# Altium schematic sheet ESP32.SchDoc
size 558 x 431 mm; SheetNumber: 1; SheetTotal: 1; ENG_APP_DATE: --/--/--; DSN_APP_DATE: --/--/--; CHK_APP_DATE: --/--/--
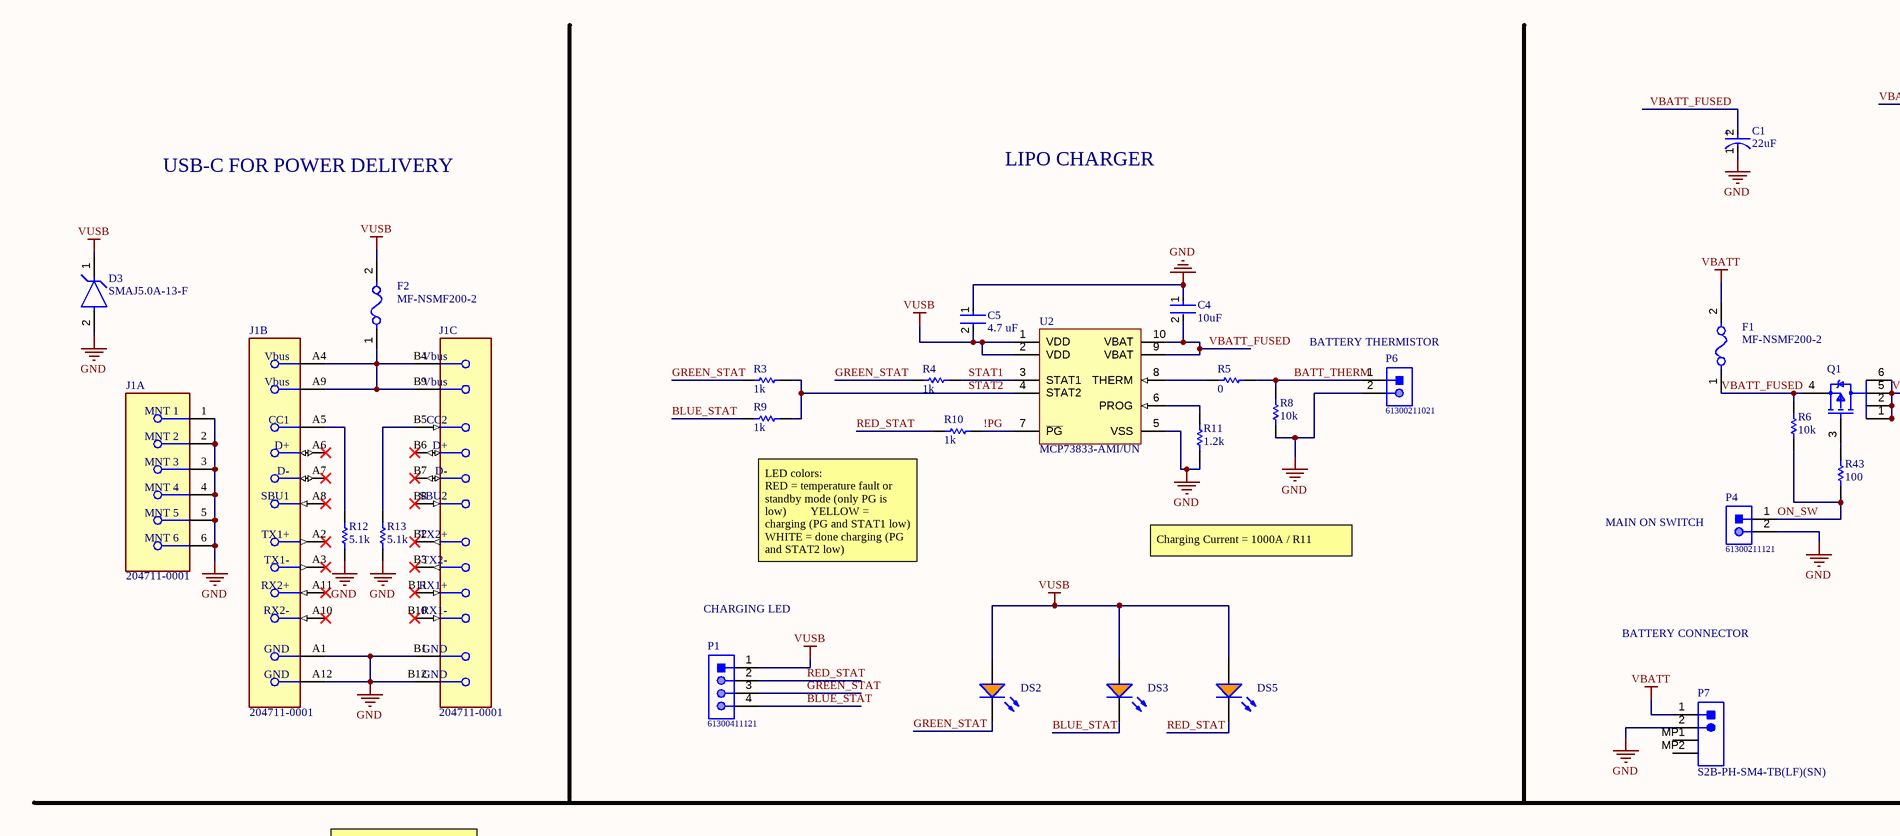
[diagram p0: ESP32.SchDoc, top left]
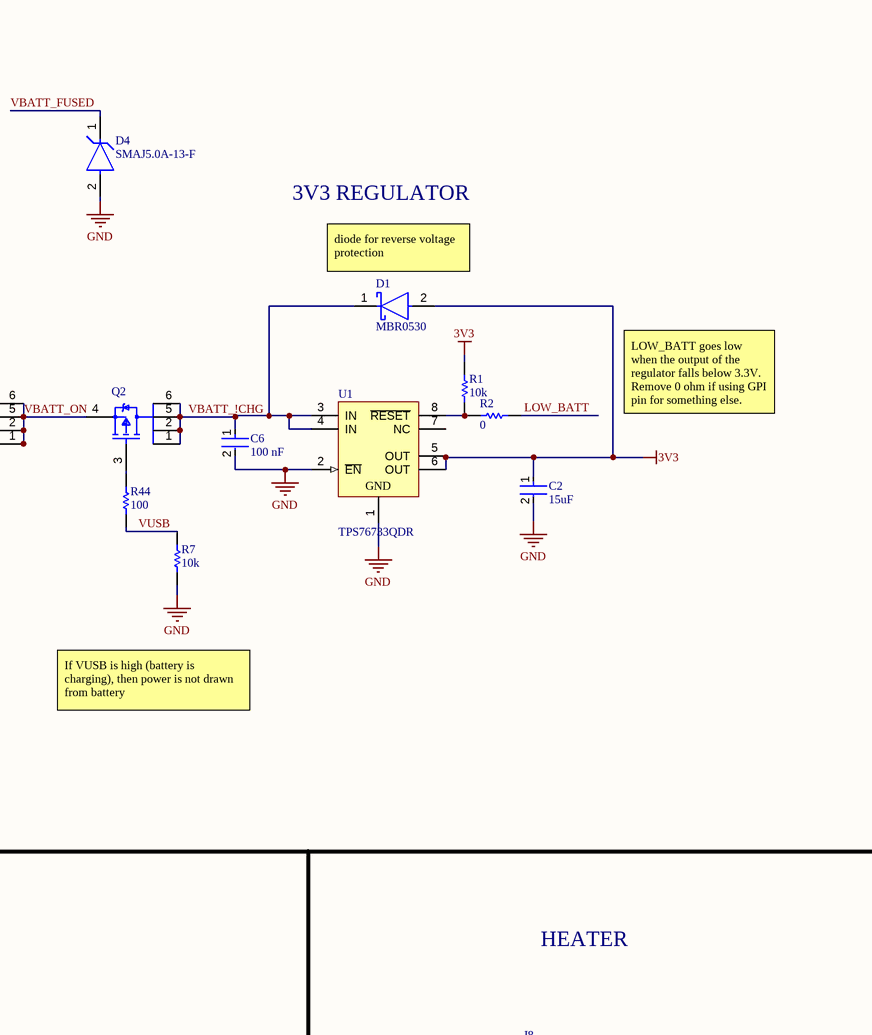
[diagram p1: ESP32.SchDoc, top right]
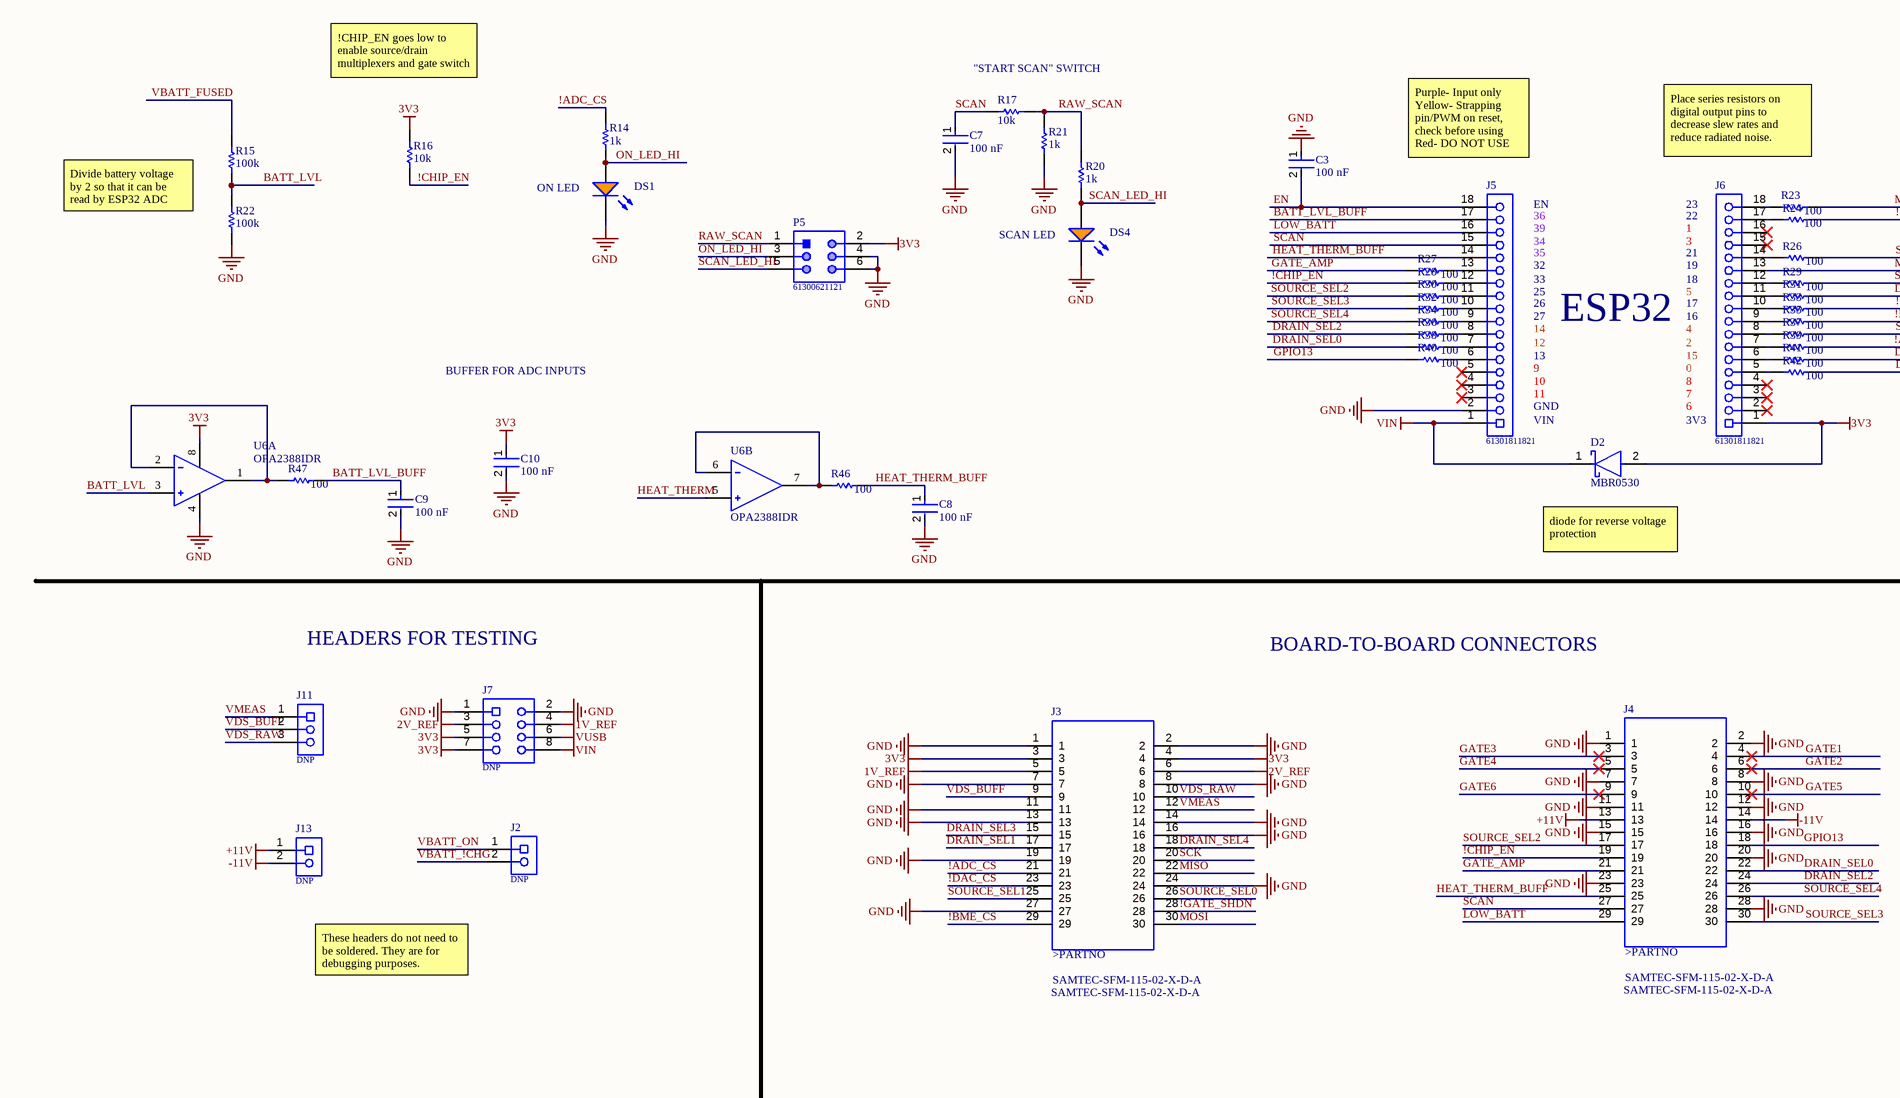
[diagram p2: ESP32.SchDoc, bottom left]
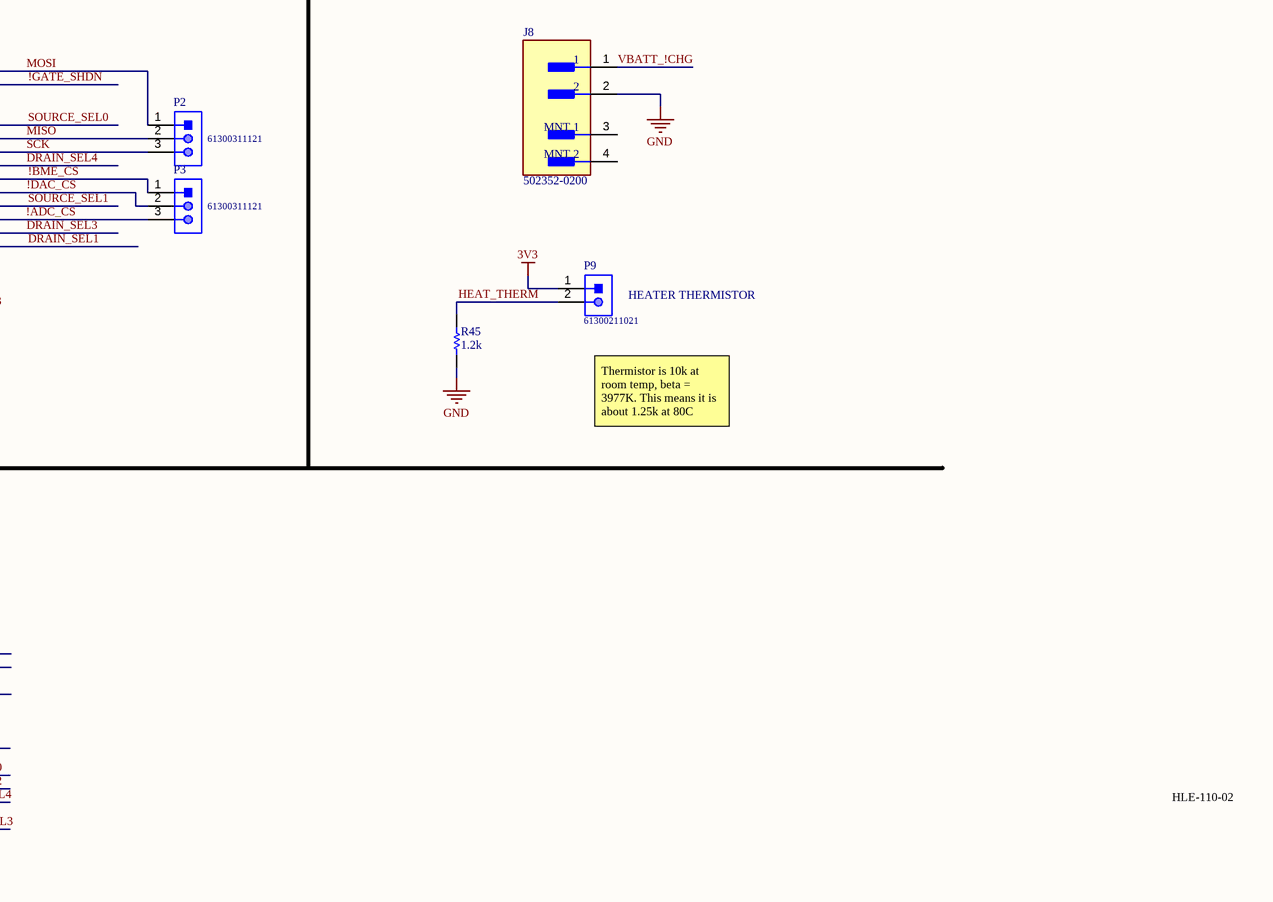
[diagram p3: ESP32.SchDoc, bottom right]

## Parts
C1  22uF  [FP-FKC-MFG]
C2  15uF  [FP-C2012-125-0_2-MFG]
C3  100 nF  [FP-C0805C-DN-MFG]
C4  10uF  [FP-GRM21B-0_1-IPC_C]
C5  4.7 uF  [FP-C0805C475K3PACTU-MFG]
C6  100 nF  [FP-C0805C-DN-MFG]
C7  100 nF  [FP-C0805C-DN-MFG]
C8  100 nF  [FP-C0805C-DN-MFG]
C9  100 nF  [FP-C0805C-DN-MFG]
C10  100 nF  [FP-C0805C-DN-MFG]
D1  MBR0530  [FP-425-04-MFG]
D2  MBR0530  [FP-425-04-MFG]
D3  SMAJ5.0A-13-F  [FP-SMA-MFG]
D4  SMAJ5.0A-13-F  [FP-SMA-MFG]
DS1  HSMD-C170  [AVAG-HSMX-C170_V]  (value not drawn)
DS2  HSMD-C170  [AVAG-HSMX-C170_V]  (value not drawn)
DS3  HSMD-C170  [AVAG-HSMX-C170_V]  (value not drawn)
DS4  HSMD-C170  [AVAG-HSMX-C170_V]  (value not drawn)
DS5  HSMD-C170  [AVAG-HSMX-C170_V]  (value not drawn)
F1  MF-NSMF200-2  [FP-MF-NSMF200-2-MFG]
F2  MF-NSMF200-2  [FP-MF-NSMF200-2-MFG]
J1  204711-0001  [FP-204711-0001-MFG]  (parts A,B,C of 3)
J2  DNP  [61300211821]
J3  SAMTEC-SFM-115-02-X-D-A  [SAMTEC-SFM-115-02-X-D-A]
J4  SAMTEC-SFM-115-02-X-D-A  [SAMTEC-SFM-115-02-X-D-A]
J5  61301811821  [61301811821]
J6  61301811821  [61301811821]
J7  DNP  [61300821821]
J8  502352-0200  [FP-502352-0200-MFG]
J11  DNP  [61300311821]
J13  DNP  [61300211821]
P1  61300411121  [61300411121]
P2  61300311121  [61300311121]
P3  61300311121  [61300311121]
P4  61300211121  [61300211121]
P5  61300621121  [61300621121]
P6  61300211021  [61300211021]
P7  S2B-PH-SM4-TB(LF)(SN)  [JST- S2B-PH-SM4-TB(LF)(SN)-2_V]
P9  61300211021  [61300211021]
Q1  SI3493DDV-T1-GE3  [FP-C-06593-MFG]  (value not drawn)
Q2  SI3493DDV-T1-GE3  [FP-C-06593-MFG]  (value not drawn)
R1  10k  [RESC2013X60X35NL10T20]
R2  0  [RESC2013X50X30LL20T20]
R3  1k  [RESC2013X55X40LL15T20]
R4  1k  [RESC2013X55X40LL15T20]
R5  0  [RESC2013X50X30LL20T20]
R6  10k  [RESC2013X60X35NL10T20]
R7  10k  [RESC2013X60X35NL10T20]
R8  10k  [RESC2013X60X35NL10T20]
R9  1k  [RESC2013X55X40LL15T20]
R10  1k  [RESC2013X55X40LL15T20]
R11  1.2k  [RESC2013X60X40LL20T25]
R12  5.1k  [RESC2013X60X40LL20T25]
R13  5.1k  [RESC2013X60X40LL20T25]
R14  1k  [RESC2013X55X40LL15T20]
R15  100k  [RESC2013X55X40LL15T20]
R16  10k  [RESC2013X60X35NL10T20]
R17  10k  [RESC2013X60X35NL10T20]
R20  1k  [RESC2013X55X40LL15T20]
R21  1k  [RESC2013X55X40LL15T20]
R22  100k  [RESC2013X55X40LL15T20]
R23  100  [RESC2013X50X30LL20T20]
R24  100  [RESC2013X50X30LL20T20]
R26  100  [RESC2013X50X30LL20T20]
R27  100  [RESC2013X50X30LL20T20]
R28  100  [RESC2013X50X30LL20T20]
R29  100  [RESC2013X50X30LL20T20]
R30  100  [RESC2013X50X30LL20T20]
R31  100  [RESC2013X50X30LL20T20]
R32  100  [RESC2013X50X30LL20T20]
R33  100  [RESC2013X50X30LL20T20]
R34  100  [RESC2013X50X30LL20T20]
R35  100  [RESC2013X50X30LL20T20]
R36  100  [RESC2013X50X30LL20T20]
R37  100  [RESC2013X50X30LL20T20]
R38  100  [RESC2013X50X30LL20T20]
R39  100  [RESC2013X50X30LL20T20]
R40  100  [RESC2013X50X30LL20T20]
R41  100  [RESC2013X50X30LL20T20]
R42  100  [RESC2013X50X30LL20T20]
R43  100  [RESC2013X50X30LL20T20]
R44  100  [RESC2013X50X30LL20T20]
R45  1.2k  [RESC2013X60X40LL20T25]
R46  100  [RESC2013X50X30LL20T20]
R47  100  [RESC2013X50X30LL20T20]
U1  TPS76733QDR  [D0008A_M]
U2  MCP73833-AMI/UN  [MSOP-UN10_L]
U6  OPA2388IDR  [FP-D0008A-IPC_B]  (parts A,B of 2)

## Nets
1V_REF: J3.5 J7.4
2V_REF: J3.6 J7.3
3V3: C2.1 C10.1 D1.2(A) D2.2(A) J3.3 J3.4 J6.1 J7.5 J7.7 P5.2 P9.1 R1.2 R16.2 U1.5(OUT) U1.6(OUT) U6.8(V+)
+11V: J4.13 J13.1
-11V: J4.14 J13.2
GND: C1.1(C) C2.2 C3.1 C4.1 C5.1 C6.2 C7.2 C8.2 C9.2 C10.2 D3.2(A) D4.2(A) DS1.2(K) DS4.2(K) J1.1(MNT_1) J1.2(MNT_2) J1.3(MNT_3) J1.4(MNT_4) J1.5(MNT_5) J1.6(MNT_6) J1.A1(GND) J1.A12(GND) J1.B1(GND) J1.B12(GND) J3.1 J3.2 J3.7 J3.8 J3.11 J3.13 J3.14 J3.16 J3.19 J3.24 J3.27 J4.1 J4.2 J4.7 J4.8 J4.11 J4.12 J4.15 J4.16 J4.20 J4.23 J4.28 J5.2 J7.1 J7.2 J8.2 P4.2 P5.4 P5.6 P6.2 P7.2 R7.1 R8.1 R11.1 R12.1 R13.1 R21.2 R22.1 R45.1 U1.1(GND) U1.2(~{EN}) U2.5(VSS) U6.4(V-)
VBATT: F1.2 P7.1
VIN: D2.1(C) J5.1 J7.8
VUSB: C5.2 D3.1(C) DS2.1(A) DS3.1(A) DS5.1(A) F2.2 J7.6 P1.1 R7.2 R44.1 U2.1(VDD) U2.2(VDD)
!ADC_CS: J3.21 P3.3 R14.2 R39.2
!BME_CS: J3.29 P3.1 R33.2
!CHIP_EN: J4.19 R16.1 R28.1
!DAC_CS: J3.23 P3.2 R35.2
!GATE_SHDN: J3.28 R24.2
!PG: R10.2 U2.7(~{PG})
BATT_LVL: R15.1 R22.2 U6.3(+IN_A)
BATT_LVL_BUFF: C9.1 J5.17 R47.2
BATT_THERM: P6.1 R5.2 R8.2
BLUE_STAT: DS3.2(K) P1.4 R9.1
DRAIN_SEL0: J4.22 R38.1
DRAIN_SEL1: J3.17 R42.2
DRAIN_SEL2: J4.24 R36.1
DRAIN_SEL3: J3.15 R41.2
DRAIN_SEL4: J3.18 R31.2
EN: C3.2 J5.18
GATE1: J4.4
GATE2: J4.6
GATE3: J4.3
GATE4: J4.5
GATE5: J4.10
GATE6: J4.9
GATE_AMP: J4.21 R27.1
GPIO13: J4.18 R40.1
GREEN_STAT: DS2.2(K) P1.3 R3.1 R4.1
HEAT_THERM: P9.2 R45.2 U6.5(+IN_B)
HEAT_THERM_BUFF: C8.1 J4.25 J5.14 R46.2
LOW_BATT: J4.29 J5.16 R2.2
MISO: J3.22 J6.13 P2.2
MOSI: J3.30 P2.1 R23.2
ON_LED_HI: DS1.1(A) P5.3 R14.1
ON_SW: P4.1 R6.2 R43.1
RAW_SCAN: P5.1 R17.1 R20.2 R21.1
RED_STAT: DS5.2(K) P1.2 R10.1
SCAN: C7.1 J4.27 J5.15 R17.2
SCAN_LED_HI: DS4.1(A) P5.5 R20.1
SCK: J3.20 P2.3 R29.2
SOURCE_SEL0: J3.26 R26.2
SOURCE_SEL1: J3.25 R37.2
SOURCE_SEL2: J4.17 R30.1
SOURCE_SEL3: J4.30 R32.1
SOURCE_SEL4: J4.26 R34.1
STAT1: R4.2 U2.3(STAT1)
STAT2: R3.2 R9.2 U2.4(STAT2)
VBATT_!CHG: C6.1 D1.1(C) J2.2 J8.1 Q2.1(D) Q2.2(D) Q2.5(D) Q2.6(D) U1.3(IN) U1.4(IN)
VBATT_FUSED: C1.2(A) C4.2 D4.1(C) F1.1 Q1.4(S) R6.1 R15.2 U2.9(VBAT) U2.10(VBAT)
VBATT_ON: J2.1 Q1.1(D) Q1.2(D) Q1.5(D) Q1.6(D) Q2.4(S)
VDS_BUFF: J3.9 J11.2
VDS_RAW: J3.10 J11.3
VMEAS: J3.12 J11.1
NetF2_1: F2.1 J1.A4(Vbus) J1.A9(Vbus) J1.B4(Vbus) J1.B9(Vbus)
NetJ1_A5: J1.A5(CC1) R12.2
NetJ1_B5: J1.B5(CC2) R13.2
NetJ5_6: J5.6 R40.2
NetJ5_7: J5.7 R38.2
NetJ5_8: J5.8 R36.2
NetJ5_9: J5.9 R34.2
NetJ5_10: J5.10 R32.2
NetJ5_11: J5.11 R30.2
NetJ5_12: J5.12 R28.2
NetJ5_13: J5.13 R27.2
NetJ6_5: J6.5 R42.1
NetJ6_6: J6.6 R41.1
NetJ6_7: J6.7 R39.1
NetJ6_8: J6.8 R37.1
NetJ6_9: J6.9 R35.1
NetJ6_10: J6.10 R33.1
NetJ6_11: J6.11 R31.1
NetJ6_12: J6.12 R29.1
NetJ6_14: J6.14 R26.1
NetJ6_17: J6.17 R24.1
NetJ6_18: J6.18 R23.1
NetQ1_3: Q1.3(G) R43.2
NetQ2_3: Q2.3(G) R44.2
NetR1_1: R1.1 R2.1 U1.8(~{RESET})
NetR5_1: R5.1 U2.8(THERM)
NetR11_2: R11.2 U2.6(PROG)
NetR46_1: R46.1 U6.6(-IN_B) U6.7(OUT_B)
NetR47_1: R47.1 U6.1(OUT_A) U6.2(-IN_A)

Not connected (* = marked no-connect by the designer): J1 A2(TX1+)* A3(TX1-)* A6(D+)* A7(D-)* A8(SBU1)* A10(RX2-)* A11(RX2+)* B2(TX2+)* B3(TX2-)* B6(D+)* B7(D-)* B8(SBU2)* B10(RX1-)* B11(RX1+)*; J5 3* 4* 5*; J6 2* 3* 4* 15* 16*; J8 3(MNT_1) 4(MNT_2); P7 MP1 MP2; U1 7(NC)

## Notes on the sheet
- USB-C FOR POWER DELIVERY
- LIPO CHARGER
- 3V3 REGULATOR
- (near D1) diode for reverse voltage protection
- (near P6) BATTERY THERMISTOR
- LOW_BATT goes low when the output of the regulator falls below 3.3V. Remove 0 ohm if using GPI pin for something else.
- LED colors:                                                                 RED = temperature fault or standby mode (only PG is low)        YELLOW = charging (PG and STAT1 low)                                                   WHITE = done charging (PG and STAT2 low)
- Charging Current = 1000A / R11
- MAIN ON SWITCH
- CHARGING LED
- BATTERY CONNECTOR
- If VUSB is high (battery is charging), then power is not drawn from battery
- !CHIP_EN goes low to enable source/drain multiplexers and gate switch
- "START SCAN" SWITCH
- HEATER
- (near J5) Purple- Input only            Yellow- Strapping pin/PWM on reset, check before using     Red- DO NOT USE
- Place series resistors on digital output pins to decrease slew rates and reduce radiated noise.
- Divide battery voltage by 2 so that it can be read by ESP32 ADC
- ON LED
- (near J5) EN
- (near J5) 36
- (near J6) 23
- (near J6) 22
- SCAN LED
- (near J5) 39
- (near J5) 34
- (near J5) 35
- (near J5) 32
- (near J5) 33
- (near J6) 1
- (near J6) 3
- (near J6) 21
- (near J6) 19
- (near J6) 18
- (near J5) 25
- (near J5) 26
- (near J5) 27
- (near J5) 14
- (near J5) 12
- ESP32
- (near J6) 5
- (near J6) 17
- (near J6) 16
- (near J6) 4
- (near J6) 2
- BUFFER FOR ADC INPUTS
- (near J5) 13
- (near J5) 9
- (near J5) 10
- (near J5) 11
- GND
- (near J6) 15
- (near J6) 0
- (near J6) 8
- (near J6) 7
- (near J6) 6
- VIN
- (near J6) 3V3
- (near P9) HEATER THERMISTOR
- Thermistor is 10k at room temp, beta = 3977K. This means it is about 1.25k at 80C
- (near D2) diode for reverse voltage protection
- HEADERS FOR TESTING
- BOARD-TO-BOARD CONNECTORS
- HLE-110-02
- These headers do not need to be soldered. They are for debugging purposes.
- DWG. NO.
- REV.
- SHT.
- REVISION
- DESCRIPTION
- DATE
- APPROVED
- THIS DOCUMENT AND THE DATA DISCLOSED HEREIN OR HEREWITH IS THE PROPERTY OF ALTIUM LIMITED AND MAY BE FREELY DISTRIBUTED IN WHOLE. NO RIGHTS ARE RESERVED OR EXPRESS OR IMPLIED WARANTEE GIVEN.
- ENG:
- DSN:
- APPROVALS
- PROJECT
- DOCUMENT REVISION:
- DESIGN ITEM:
- CHK:
- BOM:
- REFERENCE DOCUMENTS
- PROJECT REVISION:
- TITLE
- FAB DWG:
- PCB DWG:
- ASSY DWG:
- SCALE:
- SIZE
- C
- CAGE CODE
- FILE NAME
- DWG NO.
- SHEET
- OF
- REV
- (in symbol CMP-05427-000063-1) +
- (in symbol SAMTEC-SFM-115-02-X-D-A) >PARTNO

## Library data of the parts
C1 = CMP-05427-000063-1: CAP ALUM 22UF 20% 35V SMD; Ripple Current: 160mA; Life (Hours): 2000Hour; Dielectric Material: Aluminium; ESR (Equivalent Series Resistance): 700mR; Leakage Current: 3uA; Mount: Surface Mount; Min Operating Temperature: -55°C; Radiation Hardening: No; Lead Free: Lead Free; Capacitance: 22uF; Packaging: Tape and Reel; Ripple Current (AC): 160mA; Case/Package: Radial; Max Operating Temperature: 105°C; Length: 5.8mm; Termination: SMD/SMT; Number of Pins: 2; Impedance: 700mR; Package Quantity: 1; Diameter: 5mm; Series: FK; REACH SVHC: No SVHC; Width: 6.5mm; Height: 5.8mm; Voltage: 35V; Construction: Cylindrical; Contact Plating: Tin; Voltage Rating (DC): 35V; Tolerance: 20%; Height - Seated (Max): 0.228inch; Material: Aluminium; Voltage Rating: 35V; RoHS Compliant: Yes
C2 = CMP-08246-007094-1: Multilayer Ceramic Capacitors 15μF ±20% 25V JB SMD 0805; Max Operating Temperature: 85°C; Width: 0.049inch; Voltage Rating (DC): 25V; Voltage Rating: 25V; Case Code (Imperial): 0805; Dielectric Material: Ceramic; Tolerance: 20%; Min Operating Temperature: -25°C; Package Quantity: 2000; Lead Free: Lead Free; Case/Package: 0805; RoHS Compliant: Yes; Capacitance: 15uF; Mount: Surface Mount; Thickness: 0.057inch; Length: 0.079inch; Packaging: Tape and Reel; Case Code (Metric): 2012; Series: C
C3 C6-C10 = CMP-2007-00279-2: CAP CER 0.1UF 50V X7R 0805; Manufacturer Part Number: C0805C104K5RACTU; Manufacturer: KEMET; Value: 0.10 μF; Tolerance: 0.1; Temperature Coefficient: 30ppm/°C; Material: Ceramic; Device Class L2: Capacitors; Temperature Range Low: -55°C; Voltage Rating: 50 V; Digikey Description: CAP CER 0.1UF 50V X7R 0805; Category: Cap; ComponentLink2Description: Datasheet; Octopart: https://octopart.com/c0805c104k5ractu-kemet-143926; RoHS: TRUE; ComponentLink2URL: https://content.kemet.com/datasheets/KEM_C1003_C0G_SMD.pdf; Temperature Characteristic: X7R; Temperature: -55°C to +125°C; Height: 0.88mm; Temperature Range High: +125°C; Device Class L1: Passive Components; Automotive: No; Lead Free: Yes; Ipc Land Pattern Name: CAPC200125X78; Device Class L3: Ceramic Capacitors; Mouser Description: Cap Ceramic 0.1uF 50V X7R 10% SMD 2.0 x 1.2 mm 125 C Paper T/R; Capacitance: 0.10 μF; Package: C0805C-DN
C4 = CMP-2007-03453-2: Chip Multilayer Ceramic Capacitors for General Purpose, 0805, 10uF, X5R, 15%, 10%, 16V; Radiation Hardening: No; Thickness: 0.053inch; Voltage Rating (DC): 16V; Lead Free: Lead Free; Package Quantity: 1; Width: 1.25mm; Case Code (Imperial): 0805; Depth: 1.25mm; Packaging: Tape and Reel; Dielectric: X5R; Max Operating Temperature: 85°C; Tolerance: 10%; Voltage Rating: 16V; Voltage: 16V; Capacitance: 10uF; Height: 1.25mm; Case Code (Metric): 2012; Material: Ceramic; Mount: Surface Mount; Case/Package: 0805; REACH SVHC: No SVHC; Length: 2mm; Min Operating Temperature: -55°C; Termination: SMD/SMT
C5 = CMP-2007-01010-2: CAP CER 4.7UF 25V X5R 0805; Tolerance: 10%; Dielectric Material: Ceramic; Dissipation Factor: 5%; Length: 2mm; Number of Pins: 2; Voltage Rating (DC): 25V; Depth: 1.25mm; Min Operating Temperature: -55°C; Capacitance: 4.7uF; Series: C0805C; Lead Free: Lead Free; Dielectric: X5R; REACH SVHC: No SVHC; Termination: SMD/SMT; Mount: PCB; Package Quantity: 2500; Contact Plating: Tin; Case Code (Imperial): 0805; Max Operating Temperature: 85°C; Width: 1.2mm; Voltage: 25V; Case/Package: 0805; Packaging: Tape and Reel; Height: 1.25mm; RoHS Compliant: Yes; Construction: Flat; Case Code (Metric): 2012; Radiation Hardening: No
D1 D2 = CMP-2000-05113-2: DIODE SCHOTTKY 30V 500MA SOD123; Polarity: Standard; Max Reverse Leakage Current: 130uA; Forward Voltage: 430mV; Element Configuration: Single; Peak Non-Repetitive Surge Current: 5.5A; REACH SVHC: No SVHC; Contact Plating: Tin; Width: 1.6mm; Weight: 0.03g; Max Reverse Voltage (DC): 30V; Mount: Surface Mount; Max Repetitive Reverse Voltage (Vrrm): 30V; Number of Pins: 2; Height: 1.03mm; Current Rating: 500mA; Max Forward Surge Current (Ifsm): 5.5A; Lead Free: Lead Free; Max Surge Current: 5.5A; Peak Reverse Current: 130uA; Min Operating Temperature: -65°C; Radiation Hardening: No; Max Operating Temperature: 150°C; Average Rectified Current: 500mA; Packaging: Tape and Reel; Length: 2.7mm; Forward Current: 500mA; Voltage Rating (DC): 30V; Package Quantity: 1; Output Current: 500mA
D3 D4 = CMP-12828-000007-1: TVS DIODE 5V 9.2V SMA; Manufacturer: Diodes Inc.; Peak Pulse Power: 400W; Number Of Channels: 1; Max Junction Temp: +150°C; Peak Pulse Current: 43.5A; Breakdown Voltage: 6.4V; Direction: Unidirectional; Standoff Height: 0.05mm; Device Class L3: unset; Mouser Description: TVS DIODE 5V 9.2V SMA; Device Class L1: Circuit Protection; Temperature Range High: +150°C; Category: Diode; ComponentLink2Description: Datasheet; Temperature Range Low: -55°C; Manufacturer Part Number: SMAJ5.0A-13-F; Device Class L2: TVS Diodes; RoHS: TRUE; Automotive: No; Footprint Url: https://www.diodes.com/assets/Package-Files/SMA.pdf; Reverse Standoff Voltage: 5V; Clamping Voltage: 9.2V; Temperature: -55°C to +150°C; Height: 2.4mm; Octopart: https://octopart.com/smaj5.0a-13-f-diodes+inc.-350158; Lead Free: Yes; Digikey Description: TVS DIODE 5V 9.2V SMA; Package: SMA; ComponentLink2URL: https://www.diodes.com/assets/Datasheets/ds19005.pdf
DS1-DS5 = CMP-2000-06421-1: LED Uni-Color Orange, 52 mW, 20 mA, -40 to 85 degC, 2-Pin SMD, RoHS, Tape and Reel; Manufacturer: Avago; Forward Current If Max: 20mA; External Length / Height: 2mm; Luminous Intensity: 8mcd; Lens Shape: Rectangular; Bulb Size: 1.25mmx1.4mm; External Width: 1.25mm; Wavelength Typ: 605nm; Dominant Wavelength: 604nm; PIV Max: 5V; Opto Mounting Orientation: Top; Viewing Angle: 170°; LED Type: Standard; Forward Voltage: 2.2V; SVHC: NoSVHC(19-Dec-2012); No. of Pins: 2; External Depth: 0.8mm; Power Dissipation Pd: 52mW; Storage Temperature Max: 85°C; Package Description: 2-Pin Surface Mount Device, Body 2 x 1.25 mm, Height 0.8 mm; MSL: MSL2A-4weeks; Operating Temperature Range: -30°Cto+85°C; Datasheet URL: http://docs.avagotech.com/docs/AV02-0551EN; Manufacturer URL: http://www.avagotech.com/; Operating Temperature Min: -30°C; Light Area Height: 1.25mm; Mounting Technology: SurfaceMount; Storage Temperature Min: -40°C; LED Mounting: SMD; Peak Wavelength: 605nm; Package / Case: SMD; Peak Forward Current: 20mA; Forward Voltage VF Max: 2.2V; Mounting Type: SMD; LED Colour: Orange; Forward Current If: 20mA; Operating Temperature Max: 85°C; Voltage Vf Typ: 2.2V; Package Reference: HSMX-C170; Datasheet Version: 03/2012; Opto Case Style: SMD; Luminous Intensity Typ: 8mcd
F1 F2 = CMP-07400-000004-1: PTC RESET FUSE 6V 2A 1206; Manufacturer: Bourns Inc.; Trip Time: 1s; Automotive Grade: Grade 3; Value: 85mΩ; Trip Current: 4A; Current Rating: 100A; RoHS: TRUE; Device Class L1: Circuit Protection; Manufacturer Part Number: MF-NSMF200-2; Height: 1.6mm; Device Class L3: unset; Ambient Temperature Range Low: -40°C; ComponentLink2URL: https://bourns.com/docs/product-datasheets/mfnsmf.pdf?sfvrsn=39c76af6_14; Lead Free: Yes; Temperature Range High: +85°C; Temperature Range Low: -40°C; Octopart: https://octopart.com/mf-nsmf200-2-bourns-90790; Ipc Land Pattern Name: CAPC325160X115; Device Class L2: PTC Resettable Fuses; ComponentLink2Description: Datasheet; Package: MF-NSMF200-2; Voltage Rating: 6V; Mouser Description: Resettable Fuses - PPTC 2V 6V 0.02ohm (R); Ambient Temperature Range High: +85°C; Hold Current: 2A; Digikey Description: PTC RESET FUSE 6V 2A 1206; Category: Fuse; Temperature: -40°C to +85°C; Automotive: Yes; Resistance: 85mΩ
J1 = CMP-04767-000011-1: USB VERTICAL TYPE C 3.1
J2 J13 = CMP-1502-01314-1: THT Vertical Socket Header WR-PHD, Pitch 2.54 mm, Single Row, 2 pins; Manufacturer: Wurth Elektronik; Rated Current: 3A; Withstanding Voltage: 500VAC; Gender: Female; Pin Number: 2; Pitch: 2.54mm; Working Voltage: 250VAC; Contact Resistance: 20mOhm; Packaging: Tray; Part Number: 61300211821; Datasheet URL: https://katalog.we-online.de/em/datasheet/6130xx11821.pdf; Row Number: Single; Orientation: Vertical; Operating Temperature: -40to125degC; Mounting Technology: THT; Package Reference: 61300211821; Manufacturer URL: http://www.we-online.de; Publisher: WurthElektronik
J3 J4 = SAMTEC-SFM-115-02-X-D-A: MF: Samtec Inc.; System: Connector; Value: *; MP: SAMTEC-SFM-115-02-X-D-A; Package: None; Price: None; Availability: Unavailable
  J4: Parameter 1: *
J5 J6 = CMP-1502-01346-1: THT Vertical Socket Header WR-PHD, Pitch 2.54 mm, Single Row, 18 pins; Manufacturer: Wurth Elektronik; Pin Number: 18; Withstanding Voltage: 500VAC; Working Voltage: 250VAC; Gender: Female; Rated Current: 3A; Contact Resistance: 20mOhm; Pitch: 2.54mm; Orientation: Vertical; Publisher: WurthElektronik; Row Number: Single; Operating Temperature: -40to125degC; Mounting Technology: THT; Packaging: Tray; Datasheet URL: https://katalog.we-online.de/em/datasheet/6130xx11821.pdf; Package Reference: 61301811821; Manufacturer URL: http://www.we-online.de; Part Number: 61301811821
J7 = CMP-1502-01329-1: THT Vertical Socket Header WR-PHD, Pitch 2.54 mm, Dual Row, 8 pins; Manufacturer: Wurth Elektronik; Withstanding Voltage: 500VAC; Pitch: 2.54mm; Pin Number: 8; Working Voltage: 250VAC; Rated Current: 3A; Contact Resistance: 20mOhm; Gender: Female; Datasheet URL: https://katalog.we-online.de/em/datasheet/6130xx21821.pdf; Manufacturer URL: http://www.we-online.de; Publisher: WurthElektronik; Packaging: Tray; Operating Temperature: -40to125degC; Part Number: 61300821821; Package Reference: 61300821821; Orientation: Vertical; Mounting Technology: THT; Row Number: Dual
J8 = CMP-04776-000115-1: CONN HEADER SMD R/A 2POS 2MM; Manufacturer: Molex; Number Of Contacts: 2; Current Rating: 3A; Conn Gender: Male; Conn Orientation: Right Angle; Voltage Rating: 125V; System: Connector; Temperature Range Low: -40°C; Ambient Temperature Range High: +105°C; Height: 6.6mm; Pitch: 2mm; Temperature Range High: +105°C; ComponentLink2URL: https://www.molex.com/webdocs/datasheets/pdf/en-us/5023520200_PCB_HEADERS.pdf; Device Class L2: Headers and Wire Housings; Contact Material: Tin,Nickel; Manufacturer Part Number: 502352-0200; Category: Conn; RoHS: TRUE; Ambient Temperature Range Low: -40°C; ComponentLink2Description: Datasheet; Digikey Description: CONN HEADER SMD R/A 2POS 2MM; Package: 502352-0200; Mouser Description: DuraClik™ Wire-to-Board Header, Single Row, Right Angle, 2 Circuits, Tin (Sn); Automotive: No; Lead Free: Yes; Octopart: https://octopart.com/502352-0200-molex-9519058; Number Of Rows: 1; Temperature: -40°C to +105°C; Device Class L1: Connectors; Device Class L3: unset; Footprint Url: https://www.molex.com/pdm_docs/sd/5023520200_sd.pdf
J11 = CMP-1502-01315-1: THT Vertical Socket Header WR-PHD, Pitch 2.54 mm, Single Row, 3 pins; Manufacturer: Wurth Elektronik; Withstanding Voltage: 500VAC; Working Voltage: 250VAC; Gender: Female; Rated Current: 3A; Contact Resistance: 20mOhm; Pin Number: 3; Pitch: 2.54mm; Mounting Technology: THT; Orientation: Vertical; Manufacturer URL: http://www.we-online.de; Row Number: Single; Part Number: 61300311821; Operating Temperature: -40to125degC; Package Reference: 61300311821; Datasheet URL: https://katalog.we-online.de/em/datasheet/6130xx11821.pdf; Publisher: WurthElektronik; Packaging: Tray
P1 = CMP-1502-01064-1: THT Vertical Pin Header WR-PHD, Pitch 2.54 mm, Single Row, 4 pins; Manufacturer: Wurth Elektronik; Withstanding Voltage: 500VAC; Rated Current: 3A; Working Voltage: 250VAC; Pin Number: 4; Gender: Male; Contact Resistance: 20mOhm; Pitch: 2.54mm; Manufacturer URL: http://www.we-online.de; Operating Temperature: -40to105degC; Packaging: Bag; Mounting Technology: THT; Package Reference: 61300411121; Datasheet URL: https://katalog.we-online.de/em/datasheet/6130xx11121.pdf; Publisher: WurthElektronik; Part Number: 61300411121; Row Number: Single; Orientation: Vertical
P2 P3 = CMP-1502-01062-1: THT Vertical Pin Header WR-PHD, Pitch 2.54 mm, Single Row, 3 pins; Manufacturer: Wurth Elektronik; Withstanding Voltage: 500VAC; Working Voltage: 250VAC; Rated Current: 3A; Pitch: 2.54mm; Pin Number: 3; Gender: Male; Contact Resistance: 20mOhm; Package Reference: 61300311121; Manufacturer URL: http://www.we-online.de; Datasheet URL: https://katalog.we-online.de/em/datasheet/6130xx11121.pdf; Operating Temperature: -40to105degC; Part Number: 61300311121; Orientation: Vertical; Packaging: Bag; Row Number: Single; Mounting Technology: THT; Publisher: WurthElektronik
P4 = CMP-1712-00002-4: THT Vertical Pin Header WR-PHD, Pitch 2.54 mm, Single Row, 2 pins; Manufacturer: Wurth Elektronik; Rated Current: 3A; Gender: Male; Withstanding Voltage: 500VAC; Working Voltage: 250VAC; Pitch: 2.54mm; Contact Resistance: 20mOhm; Pin Number: 2; Mounting Technology: THT; Orientation: Vertical; Operating Temperature: -40to105degC; Packaging: Bag; Publisher: WurthElektronik; Datasheet URL: https://katalog.we-online.de/em/datasheet/6130xx11121.pdf; Manufacturer URL: http://www.we-online.de; Row Number: Single; Package Reference: 61300211121; Part Number: 61300211121
P5 = CMP-1502-01072-1: THT Vertical Pin Header WR-PHD, Pitch 2.54 mm, Dual Row, 6 pins; Manufacturer: Wurth Elektronik; Contact Resistance: 20mOhm; Withstanding Voltage: 500VAC; Pin Number: 6; Gender: Male; Pitch: 2.54mm; Working Voltage: 250VAC; Rated Current: 3A; Packaging: Bag; Row Number: Dual; Manufacturer URL: http://www.we-online.de; Part Number: 61300621121; Operating Temperature: -40to105degC; Mounting Technology: THT; Package Reference: 61300621121; Datasheet URL: https://katalog.we-online.de/em/datasheet/6130xx21121.pdf; Orientation: Vertical; Publisher: WurthElektronik
P6 P9 = CMP-1502-01059-1: THT Angled Pin Header WR-PHD, Pitch 2.54 mm, Single Row, 2 pins; Manufacturer: Wurth Elektronik; Withstanding Voltage: 500VAC; Gender: Male; Pitch: 2.54mm; Pin Number: 2; Rated Current: 3A; Contact Resistance: 20mOhm; Working Voltage: 250VAC; Mounting Technology: THT; Part Number: 61300211021; Manufacturer URL: http://www.we-online.de; Operating Temperature: -40to105degC; Row Number: Single; Publisher: WurthElektronik; Orientation: Angled; Datasheet URL: https://katalog.we-online.de/em/datasheet/6130xx11021.pdf; Packaging: Bag; Package Reference: 61300211021
P7 = CMP-1755-00001-1: Male Header, Pitch 2 mm, 1 x 2 Position, Height 5.5 mm, -25 to 85 degC, RoHS, Tape and Reel; Current Rating: 3 A; ComponentLink1URL: http://www.jst.com/home2.html; Radiation Hardening: No; RoHSCompliant: True; Mount: Through Hole; Contact Material: Bronze; Package Quantity: 100; Width: 2.34 mm; DatasheetVersion: Dec-12; Height: 8.13 mm; Max Operating Temperature: 105degC; ComponentLink2Description: Datasheet; Lead Pitch: 0.1 inch; Contact Finish: Lead; Packaging: Bulk; Colour: Black; Contact Plating: Tin; Min Operating Temperature: -65degC; ComponentLink1Description: Manufacturer URL; PackageReference: S2B-PH-SM4-TB(LF)(SN)-2; PackageDescription: Male Header, Pitch 2 mm, 1 x 2 Position, Height 5.5 mm; ComponentLink2URL: http://www.jst-mfg.com/product/pdf/eng/ePH.pdf; Pins: 40; Length: 101.19 mm
Q1 Q2 = CMP-02550-000156-1: MOSFET P-CHANNEL 20V 8A 6TSOP; Manufacturer: Vishay; Rthja Max: 62.5°C/W; Number Of Channels: 1; Reverse Recovery Time: 21ns; Max Forward Diode Voltage: -1.2V; Threshold Vgs Min: -0.4V; Turn Off Delay Time: 95ns; Input Capacitace At Vds: 1825pF @ -10V; Typ Forward Diode Voltage: -0.8V; Threshold Vgs Max: -1V; Continuous Drain Current: -7.5A; Gate Charge At Vgs: 34.8nC @ -8V; Depletion Mode: False; Drain To Source Breakdown Voltage: -20V; Pulse Drain Current: -32A; Reverse Recovery Charge: 34.8nC; Transconductance: 30S; Max Junction Temp: +150°C; Standoff Height: 0.01mm; Drain To Source Resistance: 0.02Ω; Power Dissipation: 2W; Turn On Delay Time: 25ns; Gate To Source Voltage: 8V; Device Class L2: Transistors; Footprint Url: https://www.vishay.com/docs/71200/71200.pdf; Category: Trans; Automotive: No; Digikey Description: MOSFET P-CHANNEL 20V 8A 6TSOP; Manufacturer Part Number: SI3493DDV-T1-GE3; Lead Free: Yes; Octopart: https://octopart.com/si3493ddv-t1-ge3-vishay-81014282; Temperature: -55°C to +150°C; ComponentLink2Description: Datasheet; Device Class L1: Discrete Semiconductors; Temperature Range High: +150°C; RoHS: TRUE; Number Of P Channels: 1; Device Class L3: MOSFETs; Height: 1.1mm; Temperature Range Low: -55°C; Package: C-06593; ComponentLink2URL: https://www.vishay.com/docs/74735/si3493ddv.pdf; Drain To Source Voltage: -20V
R1 R6-R8 R16 R17 = CMP-1659-00013-4: Chip Resistor, 10 KOhm, +/- 1%, 0.125 W, -55 to 155 degC, 0805 (2012 Metric), RoHS, Tape and Reel; Manufacturer: Yageo; Voltage Rating: 150 V; Mount: Surface Mount; ComponentLink1Description: Manufacturer URL; ComponentLink2URL: http://www.yageo.com/documents/recent/PYu-RC_Group_51_RoHS_L_04.pdf; Pins: 2; Length: 2 mm; Min Operating Temperature: -55 degC; Height: 0.5 mm; Mounting Technology: Surface Mount; RoHSCompliant: true; REACH SVHC: No SVHC; ComponentLink1URL: http://www.yageo.com/; Max Operating Temperature: 155 degC; PackageReference: 0805; DatasheetVersion: Rev. 4, 02/2016; Package Quantity: 5000; Packaging: Tape and Reel; ComponentLink2Description: Datasheet; PackageDescription: 2-Pin Surface Mounted Device, Body 2 x 1.25 mm
R2 R5 = CMP-2001-04896-1: Manufacturer: Vishay Dale; Part Number: CRCW08050000Z0EA
R3 R4 R9 R10 R14 R20 R21 = CMP-2001-04738-1: TNPW08051K00BEEN; Manufacturer: Vishay Dale; Part Number: TNPW08051K00BEEN
R11 R45 = CMP-2001-00589-1: precision 0.1%; Manufacturer: Panasonic; Part Number: ERA6AEB122V
R12 R13 = CMP-2001-00649-1: Manufacturer: Panasonic; Part Number: ERA6AEB512V
R15 R22 = CMP-2001-04720-1: precision 0.1%; Part Number: TNPW0805100KBEEA; Manufacturer: Vishay Dale
R23 R24 R26-R44 R46 R47 = CMP-2001-04901-1: Manufacturer: Vishay Dale; Part Number: CRCW0805100RFKEA
U1 = CMP-0395-00126-2: Single Output Fast Transient Response LDO, 1 A, Fixed 3.3 V Output, 2.7 to 10 V Input, with Low IQ, 8-pin SOIC (D), -40 to 125 degC, Green (RoHS & no Sb/Br); Manufacturer: Texas Instruments; Vin(Max)(V): 10; Vout Adj(Max)(V): 3.3; SubFamily: Single Channel LDO; Vdo(Typ)(mV): 350; Vin(Min)(V): 2.7; Accuracy(%): 2; Iq(Typ)(mA): 0.08; Iout(Max)(A): 1; ComponentLink3Description: Package Specification; PackageReference: D0008A; PartNumber: TPS76733QDR; PackageDescription: 8-Pin Plastic Small Outline, Body 4.9 x 3.9 mm, Pitch 1.27 mm; ComponentLink1Description: Manufacturer URL; Vout Adj(Min)(V): 3.3; ComponentLink2URL: http://www.ti.com/general/docs/lit/getliterature.tsp?genericPartNumber=TPS76733&fileType=pdf; Eco-Plan: Green (RoHS & no Sb/Br); Fixed Output Options(V): 3.3; ComponentLink3URL: http://www.ti.com/litv/pdf/msoi002j; Mounting Technology: Surface Mount; PackageVersion: 4040047-3/M; ComponentLink1URL: http://www.ti.com/; Code_JEDEC: MS-012; DatasheetVersion: SLVS208I; ComponentLink2Description: Datasheet
U2 = CMP-0133-00182-1: Stand-Alone Linear Li-Ion/Li-Polymer Charge Management Controller with Power-Good Output, 4.2V, 10-Pin MSOP, Industrial Temperature; PackageDescription: 10-Lead Plastic Micro Small Outline Package (UN) [MSOP]; PackageReference: MSOP-UN10; PackageVersion: revBB, Aug-2009; DatasheetVersion: revB, May-2009
U6 = CMP-04895-000483-1: IC OPAMP ZER-DRIFT 2CIRC 8SOIC; Number of Channels: 2; Max Operating Temperature: 125°C; RoHS Compliant: Yes; Min Operating Temperature: -40°C